# Altium schematic sheet Sheet3.2_AMP.SchDoc
size A
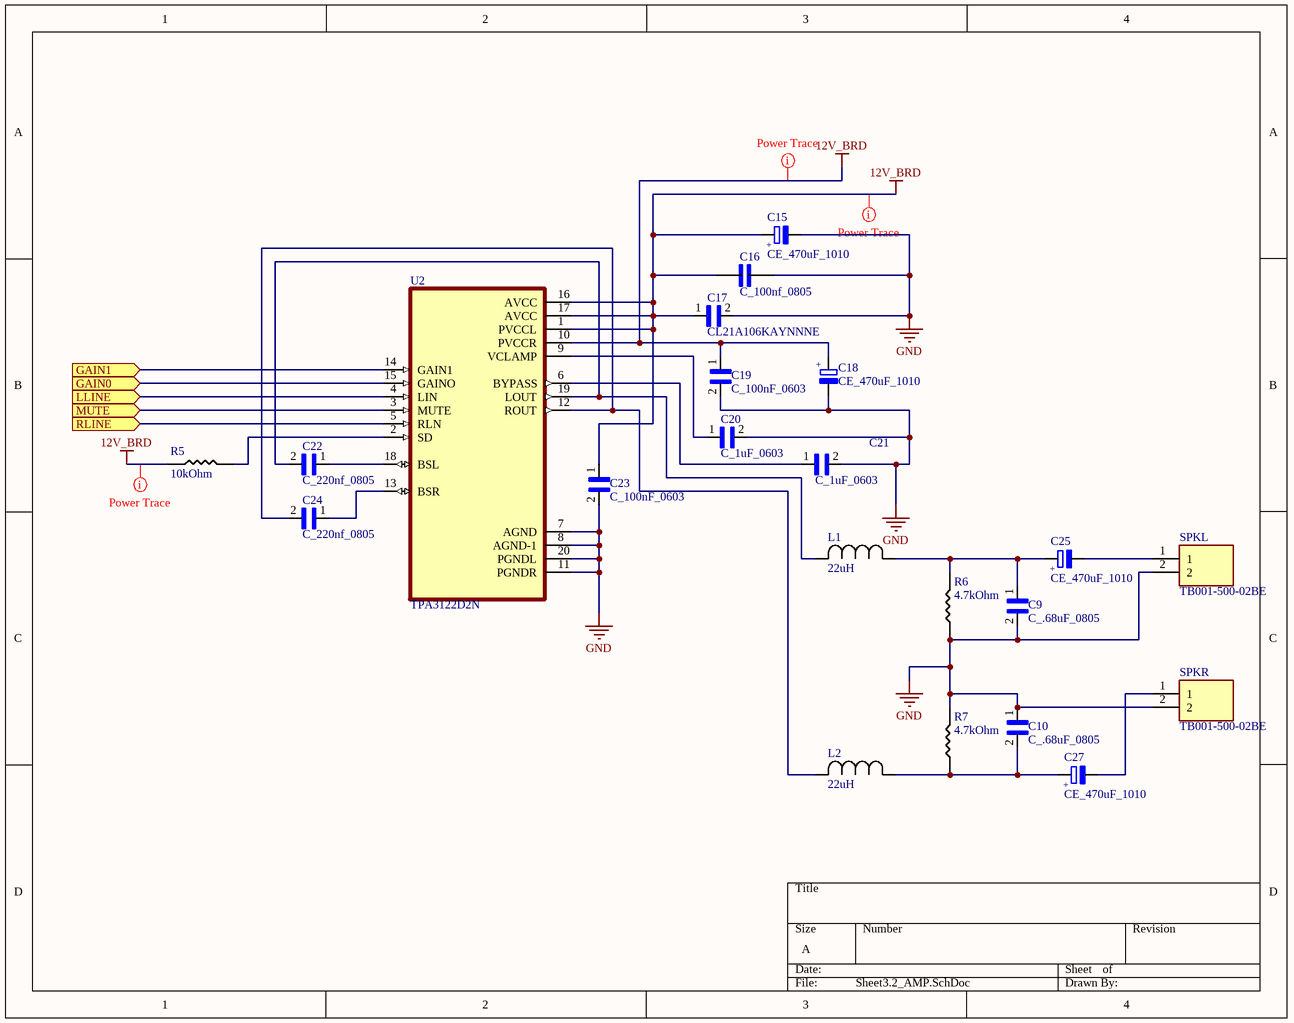
[diagram p0: Sheet3.2_AMP.SchDoc]

## Parts
C9  C_.68uF_0805  [CAPC2012X140N]
C10  C_.68uF_0805  [CAPC2012X140N]
C15  CE_470uF_1010  [140CLH-1010]
C16  C_100nf_0805  [CAPC2012X70]
C17  CL21A106KAYNNNE  [CAPC2012X135N]
C18  CE_470uF_1010  [140CLH-1010]
C19  C_100nF_0603  [CAPC1608X90]
C20  C_1uF_0603  [CAPC1608X90N]
C21  C_1uF_0603  [CAPC1608X90N]
C22  C_220nf_0805  [CAPC2012X135N]
C23  C_100nF_0603  [CAPC1608X90]
C24  C_220nf_0805  [CAPC2012X135N]
C25  CE_470uF_1010  [140CLH-1010]
C27  CE_470uF_1010  [140CLH-1010]
L1  22uH  [L0805]
L2  22uH  [L0805]
R5  value 10kOhm  [R0805]  (hidden comment: 10 kOhm)
R6  4.7kOhm  [R0805]
R7  4.7kOhm  [R0805]
SPKL  TB001-500-02BE  [CUI_TB001-500-02BE]
SPKR  TB001-500-02BE  [CUI_TB001-500-02BE]
U2  TPA3122D2N  [DIP20-2.54-26.2X7.62MM]

## Ports
GAIN0 (in), GAIN1 (in), LLINE (in), MUTE (in), RLINE (in)

## Nets
12V_BRD: C15.POS C16.1 C17.1 C18.POS C19.1 C23.1 R5.1 U2.1(PVCCL) U2.10(PVCCR) U2.16(AVCC) U2.17(AVCC)
GND: C9.2 C10.1 C15.NEG C16.2 C17.2 C18.NEG C19.2 C20.2 C21.2 C23.2 R6.1 R7.2 SPKL.2 SPKR.2 U2.7(AGND) U2.8(AGND-1) U2.11(PGNDR) U2.20(PGNDL)
GAIN0: U2.15(GAINO) ; port GAIN0
GAIN1: U2.14(GAIN1) ; port GAIN1
LLINE: U2.4(LIN) ; port LLINE
MUTE: U2.3(MUTE) ; port MUTE
RLINE: U2.5(RLN) ; port RLINE
NetC9_1: C9.1 C25.POS L1.1 R6.2
NetC10_2: C10.2 C27.POS L2.1 R7.1
NetC20_1: C20.1 U2.9(VCLAMP)
NetC21_1: C21.1 U2.6(BYPASS)
NetC22_1: C22.1 U2.18(BSL)
NetC22_2: C22.2 L1.2 U2.19(LOUT)
NetC24_1: C24.1 U2.13(BSR)
NetC24_2: C24.2 L2.2 U2.12(ROUT)
NetC25_NEG: C25.NEG SPKL.1
NetC27_NEG: C27.NEG SPKR.1
NetR5_2: R5.2 U2.2(SD)

## Layout directives
rule Width Constraint [Pref Width = 13mil    Min Width = 6mil    Max Width = 100mil]: 12V_BRD

## Notes on the sheet
- (in symbol CE_470uF_1010) +

## Library data of the parts
C9 C10 = C_.68uF_0805: .68µF 0805 ±20% 25V Ceramic Capacitor X5R 0805 (2012 Metric); MF: Samsung; MP: CL21B684KOFNNNE; Value: *; Package: 0805 Samsung; LCSC#: C71069
C15 C18 C25 C27 = CE_470uF_1010: Aluminum Electrolytic Capacitors - SMD; MP: VZH471M1ETR-1010; MF: Lelon; Package: None; Availability: Unavailable; Value: *; SnapEDA_Link: https://www.snapeda.com/parts/VZH471M1ETR-1010/Lelon/view-part/2450679/?ref=snap; Price: None; LCSC#: C249933
C16 = C_100nf_0805: 0.1ÂµF Â±10% 50V Ceramic Capacitor X7R 0805 _2012 Metric_  CC0805KRX7R9BB104; MF: Yageo; Value: *; LCSC#: C49678; SnapEDA_Link: https://www.snapeda.com/parts/CC0805KRX7R9BB104/Yageo/view-part/105548/?ref=snap; Package: 0805 Yageo; MP: CC0805KRX7R9BB104; Price: None
C17 = CL21A106KAYNNNE: 10ÂµF Â±10% 25V Ceramic Capacitor X5R 0805 (2012 Metric)CL21A106KAYNNNE; MF: Samsung; Value: *; Check_prices: https://www.snapeda.com/parts/CL21A106KAYNNNE/Samsung/view-part/3598482/?ref=eda; Package: 0805 Samsung; SnapEDA_Link: https://www.snapeda.com/parts/CL21A106KAYNNNE/Samsung/view-part/3598482/?ref=snap; MP: CL21A106KAYNNNE; LCSC#: C15850
C19 C23 = C_100nF_0603: 0.1µF/100nF  Â±10% 50V Ceramic Capacitor X7R 0603 _1608 Metric_; MP: CC0603KRX7R9BB104; MF: Yageo; Digi-Key_Purchase_URL: https://www.digikey.com/product-detail/en/yageo/CC0603KRX7R9BB104/311-1344-1-ND/2103128?utm_source=snapeda&utm_medium=aggregator&utm_campaign=symbol; Digi-Key_Part_Number: 311-1344-1-ND; Package: 0603 Yageo; LCSC#: C14663; SnapEDA Link: https://www.snapeda.com/parts/CC0603KRX7R9BB104/Yageo/view-part/78680/?ref=snap
C20 C21 = C_1uF_0603: 1uF ±10% 50V Ceramic Capacitor X7R 0603 (1608 Metric); MP: CL10A105KB8NNNC; MF: Samsung; Price: None; SnapEDA_Link: https://www.snapeda.com/parts/CL10B102KB8NNNC/Samsung/view-part/544114/?ref=snap; Availability: Good; Package: 0603 Samsung; Value: 1uF; LCSC#: c15849
C22 C24 = C_220nf_0805: CL21B224KBFNNNE; Package: None; LCSC#: C5378; Value: *; MP: CL21B224KBFNNNE; Availability: Unavailable
L1 L2 = L_22uH: 22uH SDFL2012T220KTF; Vendor: Sunlord; Built_By: Jonas Cooper; Manufacturer_Part_Number: SDFL2012T220KTF; LCSC: C32375
R5 = R_10kOhm_0805: 10kOhm +-1%  0805; MFR: Uniroyal; Mfr#: 0805W8F1002T5E; LCSC#: C17414
R6 R7 = R_4.7kOhm_0805: 4.7kOhm +-1%  0805; MFR: Uniroyal; Mfr#: 0805W8F4701T5E; LCSC#: C17673; Value: 4.7kOhm
SPKL SPKR = TB001-500-02BE: 2~24 Poles, Screw Type, Horizontal, 5.0 Pitch, 22~12 _AWG_, Terminal Block Connector; MF: CUI Devices; MP: TB001-500-02BE; Availability: Unavailable; SnapEDA_Link: https://www.snapeda.com/parts/TB001-500-02BE/CUI%20Devices/view-part/3590292/?ref=snap; CUI_purchase_URL: https://www.cuidevices.com/product/interconnect/connectors/terminal-blocks/tb001-500-series?utm_source=snapeda.com&utm_medium=referral&utm_campaign=snapedaBOM; Package: None; Price: None; Value: *
U2 = TPA3122D2N: 15-W stereo, 30-W mono, 10- to 26-V supply, analog input Class-D audio amplifier w/ SE output in DIP 20-PDIP -40 to 85; MF: Texas Instruments; Check_prices: https://www.snapeda.com/parts/TPA3122D2N/Texas%20Instruments/view-part/321530/?ref=eda; SnapEDA_Link: https://www.snapeda.com/parts/TPA3122D2N/Texas%20Instruments/view-part/321530/?ref=snap; Availability: Warning; Value: *; Price: None; MP: TPA3122D2N; Package: PDIP-20 Texas Instruments; Purchase-URL: https://pricing.snapeda.com/search/part/TPA3122D2N/?ref=eda